# EAGLE design NeatoLDS Breakout Board_v1.0 (EAGLE 6.5.0)
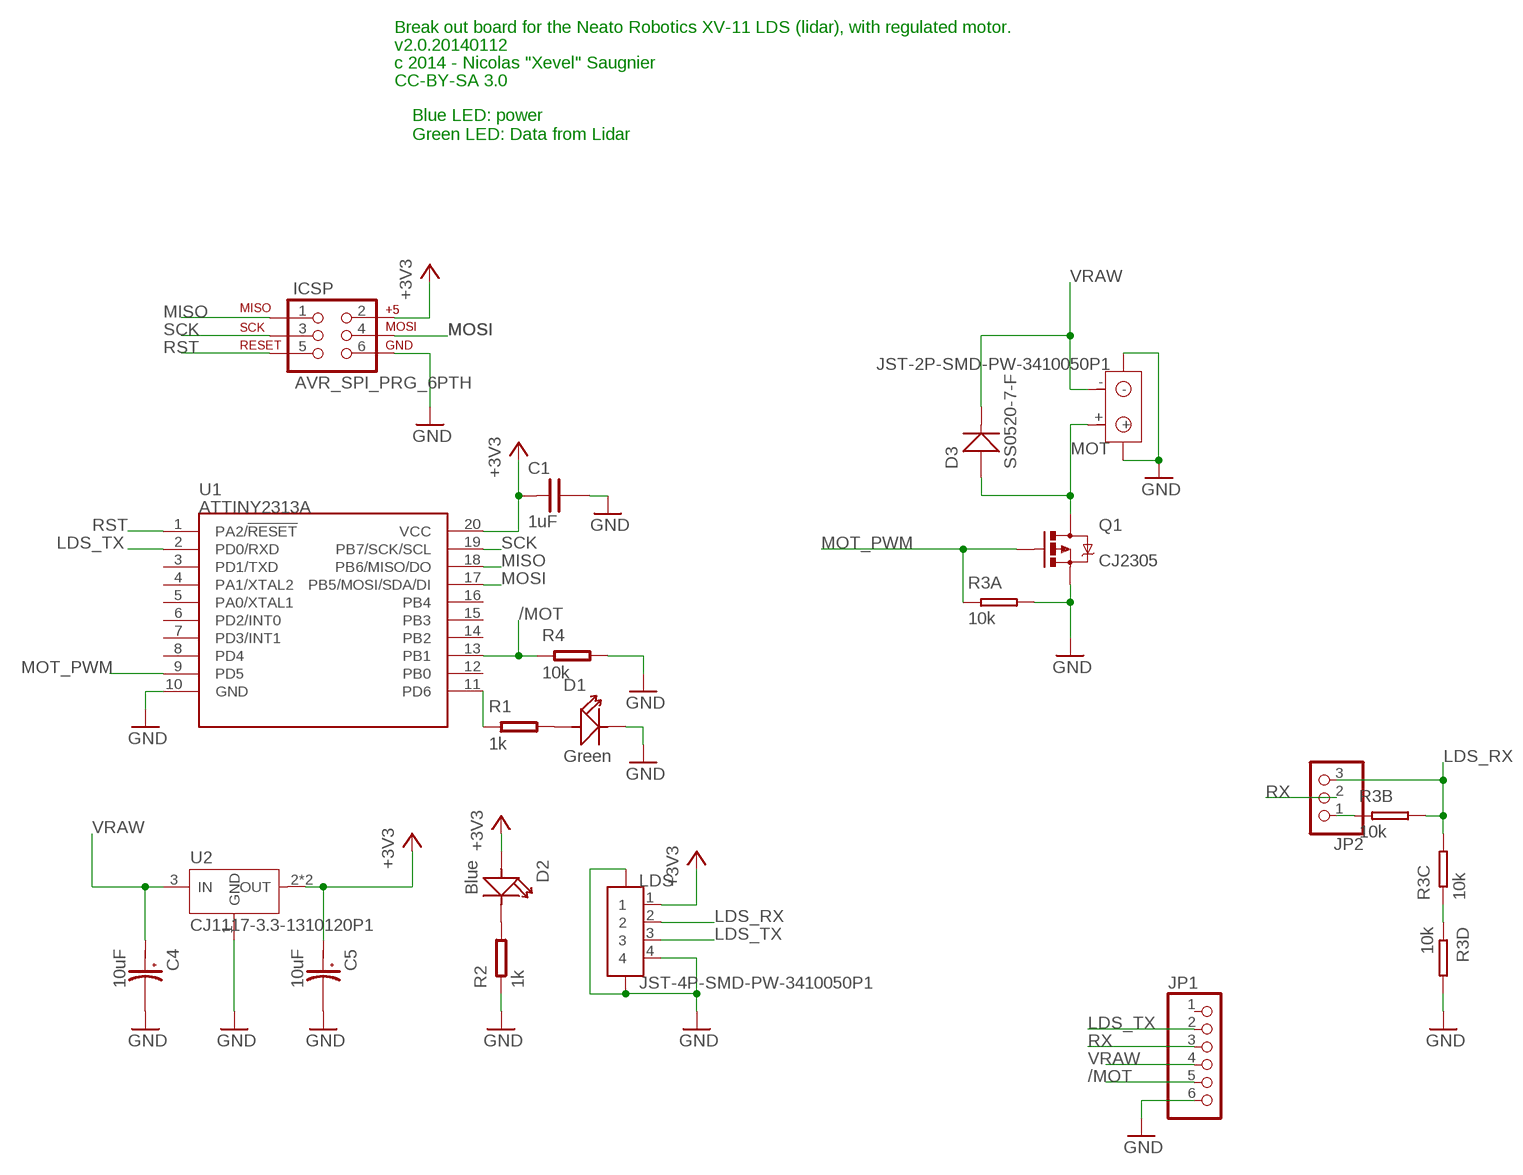
[diagram p0: schematic, sheet 1]

## Parts
C1  1uF  C-0603  [C0603]
C4  10uF  C-POLAR-A  [AVX-A]
C5  10uF  C-POLAR-A  [AVX-A]
D1  Green  LED  [LED0603]
D2  Blue  LED  [LED0603]
D3  SS0520-7-F  D-SOD-123  [SOD123]
ICSP  AVR_SPI_PRG_6PTH  [2X3]
JP1  PINHD-1X6  [1X06]
JP2  PINHD-1X3  [1X03]
LDS  JST-4P-SMD-PW-3410050P1  [CON-4P-SMD-2.0-90D]
MOT  JST-2P-SMD-PW-3410050P1  [2P-SMD-2.0-90D]
Q1  CJ2305  MOSFET_P_FDN308P  [SOT-23-3_N/SSOT-3_N]
R1  1k  R-0603  [R0603]
R2  1k  R-0603  [R0603]
R3  10k  R-4R  [R1206-8]
R4  10k  R-0603  [R0603]
U1  ATTINY2313A  [SOP20W]
U2  CJ1117-3.3-1310120P1  [SOT89]

## Nets
+3V3: C1.1 C5.+ D2.+ ICSP.2 LDS.1 U1.20(VCC) U2.2(OUT) U2.4(OUT)
/MOT: JP1.5 R4.1 U1.13(PB1)
GND: C1.2 C4.- C5.- D1.- ICSP.6 JP1.6 LDS.4 LDS.5 LDS.6 MOT.3 MOT.4 Q1.2(S) R2.1 R3.5 R3.8 R4.2 U1.10(GND) U2.1(GND)
LDS_RX: JP2.3 LDS.2 R3.6 R3.7
LDS_TX: JP1.2 LDS.3 U1.2(PD0/RXD)
MISO: ICSP.1 U1.18(PB6/MISO/DO)
MOSI: ICSP.4 U1.17(PB5/MOSI/SDA/DI)
MOT_PWM: Q1.1(G) R3.1 U1.9(PD5)
N$1: R3.3 R3.4
N$2: JP2.1 R3.2
N$3: R1.1 U1.11(PD6)
N$4: D3.+ MOT.+ Q1.3(D)
N$5: D1.+ R1.2
N$7: D2.- R2.2
RST: ICSP.5 U1.1(PA2/!RESET)
RX: JP1.3 JP2.2
SCK: ICSP.3 U1.19(PB7/SCK/SCL)
VRAW: C4.+ D3.- JP1.4 MOT.- U2.3(IN)
Unconnected: JP1.1 U1.3(PD1/TXD) U1.4(PA1/XTAL2) U1.5(PA0/XTAL1) U1.6(PD2/INT0) U1.7(PD3/INT1) U1.8(PD4) U1.12(PB0) U1.14(PB2) U1.15(PB3) U1.16(PB4)

## Notes on the sheet
- Break out board for the Neato Robotics XV-11 LDS (lidar), with regulated motor.
- v2.0.20140112
- c 2014 - Nicolas "Xevel" Saugnier
- CC-BY-SA 3.0
- Blue LED: power
  Green LED: Data from Lidar

## Library data of the parts
C1 = OPL:C*
C4 C5 = OPL:C-POLAR*
D1 D2 = OPL:LED*: LED
D3 = OPL:D*: DIODE
ICSP = SparkFun-Connectors:AVR_SPI_PRG_6: AVR ISP 6 Pin This is the reduced ISP connector for AVR programming. Common on Arduino. This footprint will take up less PCB space and can be used with a 10-pin to 6-pin adapter such as SKU: BOB-08508
JP1 = pinhead:PINHD-1X6: PIN HEADER
JP2 = pinhead:PINHD-1X3: PIN HEADER
LDS = Xevelabs:JST-4P-SMD-PW
MOT = OPL:JST-2P-SMD-PW
Q1 = Xevelabs:MOSFET_P
R1 R2 R4 = OPL:R*
R3 = OPL:R-4R*: Resistor Array
U1 = SparkFun-DigitalIC:ATTINY2313A: ATTINY2313A 2kB 20MHz I2C/SPI/UART; PROD_ID: IC-11305
U2 = OPL:CJ1117-3.3: 1A Low Dropout Linear Regulator

## Board
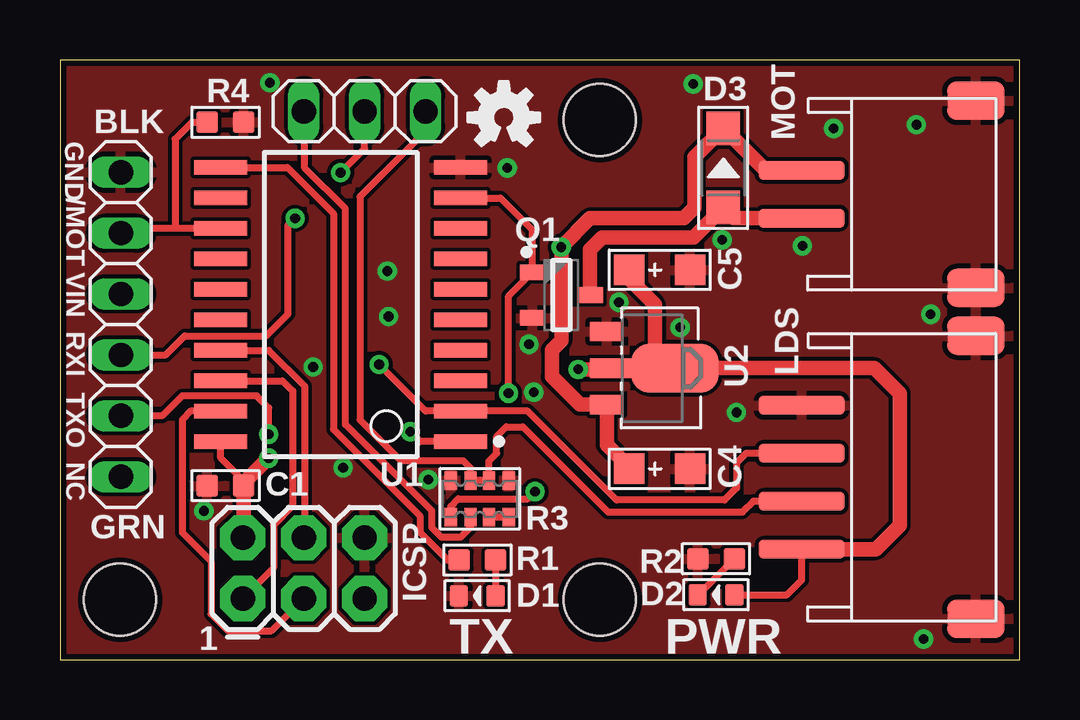
[diagram p1: board, top side]
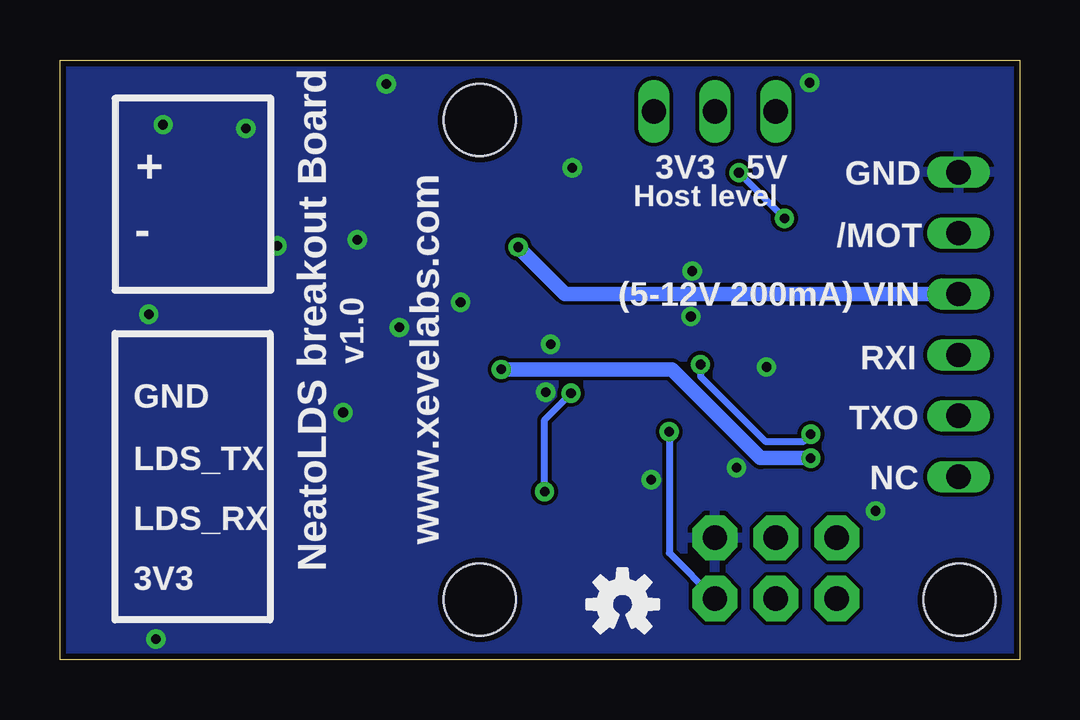
[diagram p2: board, bottom side, seen from below]

Size 40 x 25 mm. Coordinates in mm from the lower left corner, seen from the top.
Outline: 0,0 40,0 40,25 0,25 0,0
Copper layers (1*16): Top 0.035mm / dielectric 1.55mm / Bottom 0.035mm
Design rules "Xevelabs_6mil_eurocircuits": minimum track width 0.15mm, minimum drill 0.25mm, track to track 0.155mm, track to pad 0.155mm, pad to pad 0.155mm, via to via 0.155mm, smd to smd 0mil, copper to edge 0.25mm, drill to drill 0.25mm, minimum pad ring 0mil, minimum via ring 0.2mm, stop-mask expansion 0mil, vias tented up to drill 100mil, thermal gap 0.2mm
Holes 3 mm at 2.5,2.5 22.5,22.5 22.5,2.5

### Footprints (pad centres in the part's own frame; a part is rotated, then mirrored left to right if it is on the bottom)
C0603 = smd 0.889 x 0.889: 1 -0.762,0; 2 0.762,0
AVX-A = smd 1.27 x 1.27: + -1.27,0; - 1.27,0
LED0603 = smd 0.762 x 0.889: + -0.762,0; - 0.762,0
SOD123 = smd 1.397 x 1.397: + -1.651,0; - 1.651,0
2X3 = drill 1.016 pad 1.88 octagon: 1 0,0; 2 0,2.54; 3 2.54,0; 4 2.54,2.54; 5 5.08,0; 6 5.08,2.54
1X06 = drill 1.016 long: 1 -6.35,0; 2 -3.81,0; 3 -1.27,0; 4 1.27,0; 5 3.81,0; 6 6.35,0
1X03 = drill 1.016 long: 1 -2.54,0; 2 0,0; 3 2.54,0
CON-4P-SMD-2.0-90D = smd 0.8 x 3.6: 1 -3,5.08; 2 -1,5.08; 3 1,5.08; 4 3,5.08 | smd 1.6 x 2.4: 5 -5.9,-2.181; 6 5.9,-2.181
2P-SMD-2.0-90D = smd 1.6 x 2.4: 3 3.9,-2.181; 4 -3.9,-2.181 | smd 0.8 x 3.6: + -1,5.08; - 1,5.08
SOT-23-3_N/SSOT-3_N = smd 1.05 x 0.65: 1 -1.2,0.95; 2 -1.2,-0.95; 3 1.2,0
R0603 = smd 0.889 x 0.889: 1 -0.762,0; 2 0.762,0
R1206-8 = smd 0.508 x 0.762: 1 -1.206,-0.762; 2 -0.381,-0.762; 3 0.381,-0.762; 4 1.206,-0.762; 5 1.206,0.762; 6 0.381,0.762; 7 -0.381,0.762; 8 -1.206,0.762
SOP20W = smd 0.6 x 2.2: 1 -5.715,-5; 2 -4.445,-5; 3 -3.175,-5; 4 -1.905,-5; 5 -0.635,-5; 6 0.635,-5; 7 1.905,-5; 8 3.175,-5; 9 4.445,-5; 10 5.715,-5; 11 5.715,5; 12 4.445,5; 13 3.175,5; 14 1.905,5; 15 0.635,5; 16 -0.635,5; 17 -1.905,5; 18 -3.175,5; 19 -4.445,5; 20 -5.715,5
SOT89 = smd 0.8 x 1.4: 1 -1.524,-1.905; 3 1.524,-1.905 | smd 0.8 x 1.9: 2 0,-1.651 | smd 2.032 x 3.65: 4 0,0.94

### Placement (x,y rotation side)
C1  6.9,7.25 180 top
C4  25,7.95 0 top
C5  25,16.25 0 top
D1  17.39,2.66 180 top
D2  27.35,2.7 180 top
D3  27.65,20.5 90 top
ICSP  7.62,2.54 0 top
JP1  2.54,13.97 90 top
JP2  12.7,22.86 0 top
LDS  36,7.6 90 top
MOT  36,19.4 90 top
Q1  20.9,15.2 0 top
R1  17.4,4.15 0 top
R2  27.35,4.2 0 top
R3  17.5,6.7 0 top
R4  6.9,22.4 0 top
U1  11.7,14.8 90 top
U2  24.7,12.15 270 top
U$1  [OSHW-LOGO-S]  18.5,22.6 0 top
U$2  [OSHW-LOGO-S]  16.55,2.3 0 bottom

### Tracks (layer width: path | path; a pad name or v marks a point on that pad's centre or on a via)
+3V3  (via drill 0.4)
  Top 0.3: D2.+ 30.3,2.7 30.92,3.32 LDS.1 | U1.20 6.7,8.4 7.66,7.44 C1.1
  Top 0.6: 24.8,12.15 U2.2 23,12.1 v21.6,12.1 | 24.8,12.15 U2.4 33.95,12.15 35,11.1 35,5.6 34,4.6 LDS.1 | C5.+ 23.73,15.87 24.8,14.8 24.8,12.15 | v8.7,8.4 7.66,7.36 C1.1 7.66,5.12 ICSP.2
  Bottom 0.6: v8.7,8.4 10.8,8.4 14.5,12.1 v21.6,12.1
/MOT
  Top 0.3: U1.13 4.8,17.98 | 4.8,17.98 2.73,17.98 JP1.5 | 4.8,17.98 4.8,21.7 5.5,22.4 R4.1
GND  (via drill 0.4)
  other vias: 8.75,24.05 13.7,14.3 10.55,12.2 28.2,10.3 30.95,17.25 36.3,14.4 35.7,22.3 23.3,14.9 6,6.2 11.8,8 18.65,20.5 32.25,22.15 27.6,17.5 13.65,16.2 36,0.85 26.4,24 25.85,13.85 15.35,7.5 19.55,13.15 19.75,11.15
  pour Bottom: -0.6,25.7 42.5,25.85 43.1,-1.8 -0.7,-0.8 -0.7,25.7
  pour Top: -1.3,25.9 43.6,27.45 42.4,-1.35 -1.3,-0.6
LDS_RX
  Top 0.3: LDS.2 28.9,6.6 28.45,6.15 22.85,6.15 19.3,9.7 18.6,9.7 18.2,9.3 18.2,8.6 17.88,8.28 R3.6 R3.7 17.12,7.98 16.8,8.3 14.2,8.3 12.5,10 12.5,19.3 15.2,22 15.2,22.82 JP2.3
LDS_TX  (via drill 0.4)
  Top 0.3: LDS.3 28.6,8.6 28.2,8.2 28.2,7.15 27.7,6.65 23.2,6.65 19.5,10.36 U1.2 15.24,10.36 v13.3,12.3 | v8.7,9.4 8.7,10.5 8.2,11 5.1,11 4.26,10.16 JP1.2
  Bottom 0.3: v13.3,12.3 13.3,11.8 10.6,9.1 9,9.1 v8.7,9.4
MISO
  Top 0.3: U1.18 9.28,11.62 9.7,11.2 9.7,6.4 8.9,5.6 8.9,3.82 ICSP.1
MOSI
  Top 0.3: U1.17 8.71,12.89 10.2,11.4 10.2,5.12 ICSP.4
MOT_PWM  (via drill 0.4)
  Top 0.3: U1.9 18.36,19.25 19.7,17.9 Q1.1 18.7,15.15 v18.7,11.1 | R3.1 16.29,6.39 16.6,6.7 19.5,6.7 v19.8,7
  Bottom 0.3: v19.8,7 19.8,10 v18.7,11.1
N$1
  Top 0.3: R3.3 R3.4
N$2
  Top 0.3: JP2.1 10.2,22.82 10.2,20.5 11.9,18.8 11.9,9.8 15.5,6.2 15.5,5.5 15.9,5.1 16.7,5.1 17.12,5.52 R3.2
N$3
  Top 0.3: U1.11 9.48,20.52 11.4,18.6 11.4,9.6 15,6 15,5.3 16.15,4.15 R1.1
N$4
  Top 0.6: MOT.+ 28.1,18.4 D3.+ 26.4,17.6 22.6,17.6 22.1,17.1 Q1.3
N$5
  Top 0.3: R1.2 D1.+
N$7
  Top 0.3: D2.- 26.59,2.68 R2.2
RST  (via drill 0.4)
  Top 0.3: U1.1 15.02,9.09 v14.6,9.5
  Bottom 0.3: v14.6,9.5 14.6,4.44 ICSP.5
RX  (via drill 0.4)
  Top 0.3: v11.7,20.3 12.7,21.3 JP2.2 | JP1.3 4.4,12.7 5.2,13.5 8.6,13.5 9.5,14.4 9.5,18.1 v9.8,18.4
  Bottom 0.3: v9.8,18.4 v11.7,20.3
SCK
  Top 0.3: U1.19 5.46,10.36 5.1,10 5.1,5.3 6.3,4.1 6.3,1.9 7,1.2 8.82,1.2 ICSP.3
VRAW  (via drill 0.4)
  Top 0.6: C4.+ 23.73,8.02 22.8,8.95 U2.3 21.67,10.63 20.5,11.8 20.5,12.9 20.9,13.3 v20.9,17.2 22.1,18.4 26,18.4 26.45,18.85 26.45,20.95 D3.- 29.4,20.4 MOT.-
  Bottom 0.6: JP1.4 18.94,15.24 v20.9,17.2

### Text on the board
tPlace: GND | BLK | /MOT | VIN | RXI | TXO | NC | GRN | TX | PWR | 1
bPlace: NeatoLDS breakout Board | GND | 5V | 3V3 | + | Host level | /MOT | - | (5-12V 200mA) VIN | v1.0 | RXI | TXO | GND | NC | LDS_TX | www.xevelabs.com | LDS_RX | 3V3